# Altium project Car_reader.PrjPcb
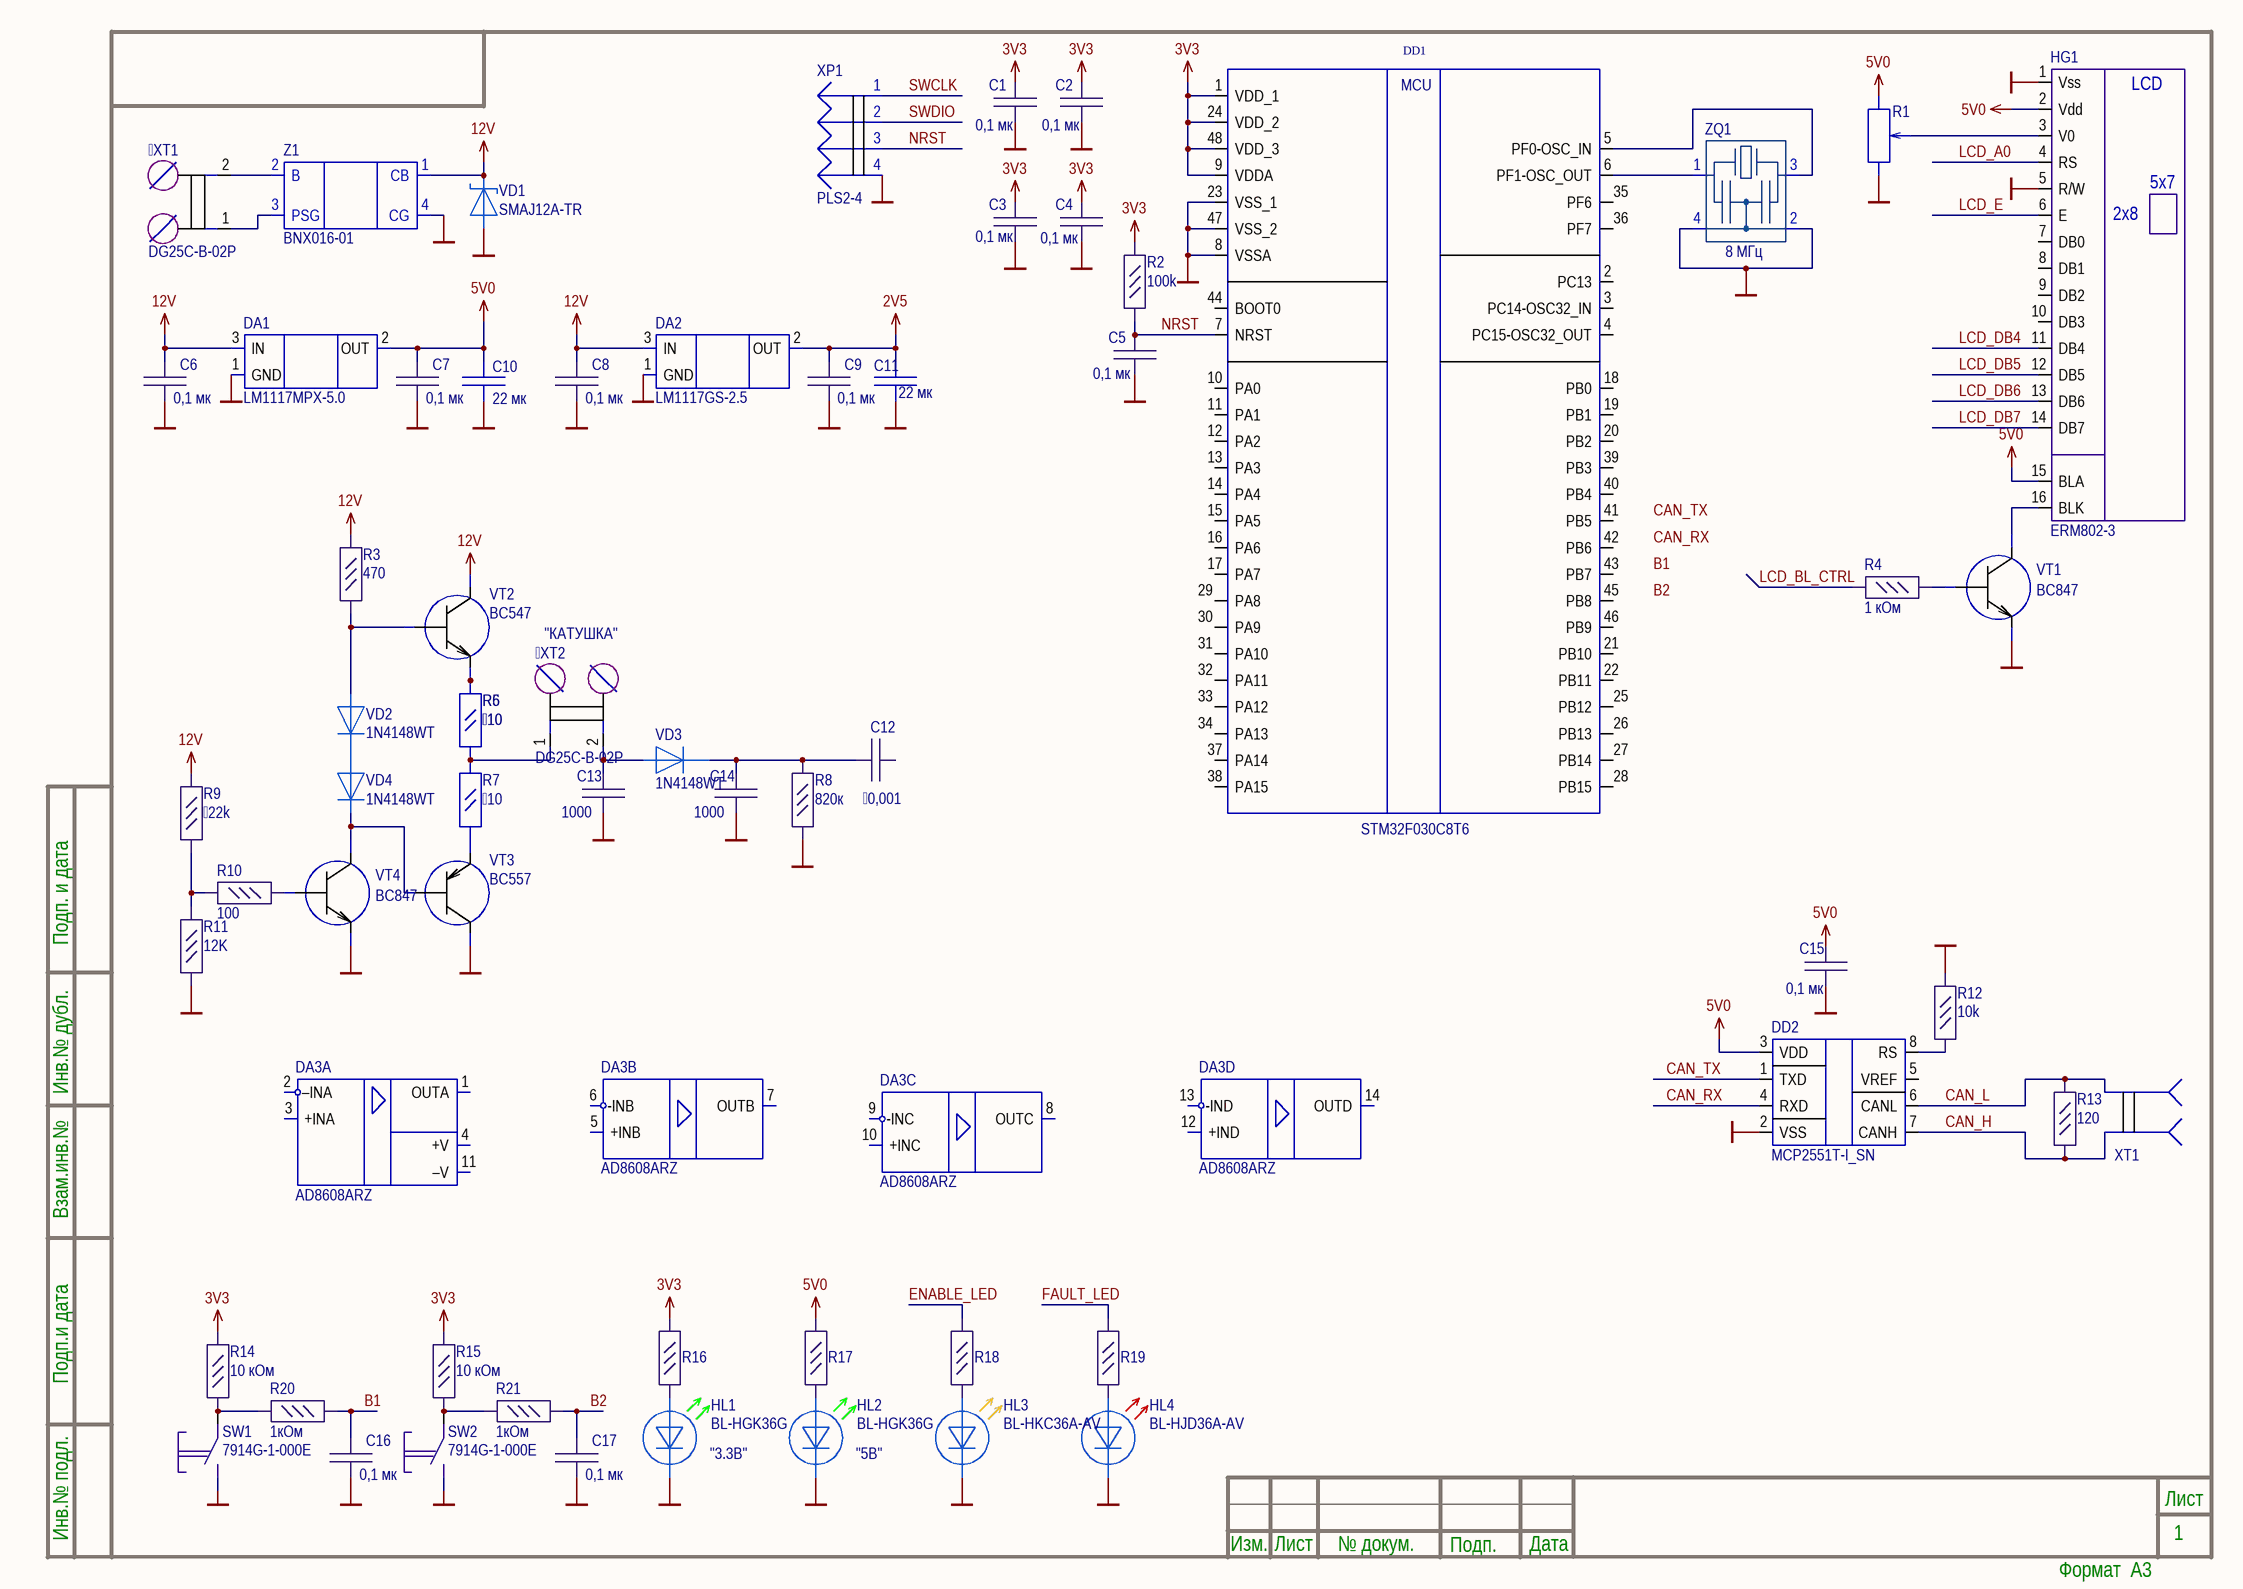
[diagram p0: Sheet1.SchDoc]
1 sheet, 64 parts. Net scope: global (net labels, ports and power ports of the same name join across sheets).
Board file: Car_reader_pcb.PcbDoc

## Sheet Sheet1.SchDoc
size 420 x 297 mm; SheetNumber: 1; SheetTotal: 1

### Parts
XT1  DG25C-B-02P  [DG25C-B-02P]
XT2  DG25C-B-02P  [DG25C-B-02P]
C1  0,1 мк  [C_0603]
C2  0,1 мк  [C_0603]
C3  0,1 мк  [C_0603]
C4  0,1 мк  [C_0603]
C5  0,1 мк  [C_0603]
C6  0,1 мк  [C_0603]
C7  0,1 мк  [C_0603]
C8  0,1 мк  [C_0603]
C9  0,1 мк  [C_0603]
C10  22 мк  [C_1210]
C11  22 мк  [C_1210]
C12  0,001  [C_0603]
C13  1000  [C_0603]
C14  1000  [C_0603]
C15  0,1 мк  [C_0603]
C16  0,1 мк  [C_0603]
C17  0,1 мк  [C_0603]
DA1  LM1117MPX-5.0  [sot223]
DA2  LM1117GS-2.5  [SOT223]
DA3  AD8608ARZ  [SO-14]  (parts A,B,C,D of 4)
DD1  STM32F030C8T6  [LQFP48]
DD2  MCP2551T-I_SN  [SOIC127P600X175-8N]
HG1  ERM802-3  [ERM802]
HL1  BL-HGK36G  [LED_0603_GREEN]
HL2  BL-HGK36G  [LED_0603_GREEN]
HL3  BL-HKC36A-AV  [LED_0603_GREEN]
HL4  BL-HJD36A-AV  [LED_0603_RED]
R1  3214W-1-103E  [3214W Bourns]  (value not drawn)
R2  100k  [R_0603]
R3  470  [R_0603]
R4  1 кОм  [R_0603]
R5  10  [R_1206]
R6  10  [R_1206]
R7  10  [R_1206]
R8  820к  [R_0603]
R9  22k  [R_0603]
R10  100  [R_0603]
R11  12K  [R_0603]
R12  10k  [R_0603]
R13  120  [R_0603]
R14  10 кОм  [R_0603]
R15  10 кОм  [R_0603]
R16  470  [R_0603]  (value not drawn)
R17  470  [R_0603]  (value not drawn)
R18  470  [R_0603]  (value not drawn)
R19  470  [R_0603]  (value not drawn)
R20  1кОм  [R_0603]
R21  1кОм  [R_0603]
SW1  7914G-1-000E  [7914G]
SW2  7914G-1-000E  [7914G]
VD1  SMAJ12A-TR  [DO-214AC]
VD2  1N4148WT  [SOD-523F]
VD3  1N4148WT  [SOD-523F]
VD4  1N4148WT  [SOD-523F]
VT1  BC847  [SOT23]
VT2  BC547  [КТ-26]
VT3  BC557  [КТ-26]
VT4  BC847  [SOT23]
XP1  PLS2-4  [PLS2-4]
XT1  DG308-2.54-02P  [DG308-2.54-02P]  (value not drawn)
Z1  BNX016-01  [BNX01]
ZQ1  8 МГц  [MJ CRYSTAL]

### Nets
2V5: C9.2 C11.2 DA2.2(OUT)
3V3: C1.2 C2.2 C3.2 C4.2 DD1.1(VDD_1) DD1.9(VDDA) DD1.24(VDD_2) DD1.48(VDD_3) R2.1 R14.2 R15.2 R16.2
5V0: C7.2 C10.1 C15.2 DA1.2(OUT) DD2.3(VDD) HG1.2(Vdd) HG1.15(BLA) R1.1 R17.2
12V: C6.2 C8.2 DA1.3(IN) DA2.3(IN) R3.1 R9.2 VD1.2 VT2.1(C) Z1.1(CB)
GND: C1.1 C2.1 C3.1 C4.1 C5.1 C6.1 C7.1 C8.1 C9.1 C10.2 C11.1 C13.1 C14.1 C15.1 C16.1 C17.1 DA1.1(GND) DA2.1(GND) DD1.8(VSSA) DD1.23(VSS_1) DD1.47(VSS_2) DD2.2(VSS) HG1.1(Vss) HG1.5(R/W) HL1.2 HL2.2 HL3.2 HL4.2 R1.3 R8.1 R11.2 R12.2 SW1.1 SW2.1 VD1.1 VT1.2(E) VT3.1(C) VT4.2(E) XP1.4 Z1.4(CG) ZQ1.2 ZQ1.4
B1: C16.2 R20.1
B2: C17.2 R21.1
CAN_H: DD2.7(CANH) R13.2 XT1.1
CAN_L: DD2.6(CANL) R13.1 XT1.2
CAN_RX: DD2.4(RXD)
CAN_TX: DD2.1(TXD)
ENABLE_LED: R18.2
FAULT_LED: R19.2
LCD_A0: HG1.4(RS)
LCD_BL_CTRL: R4.2
LCD_DB4: HG1.11(DB4)
LCD_DB5: HG1.12(DB5)
LCD_DB6: HG1.13(DB6)
LCD_DB7: HG1.14(DB7)
LCD_E: HG1.6(E)
NRST: C5.2 DD1.7(NRST) R2.2 XP1.3
SWCLK: XP1.1
SWDIO: XP1.2
NetXT1_1: XT1.1 Z1.3(PSG)
NetXT1_2: XT1.2 Z1.2(B)
NetXT2_1: XT2.1 R5.1 R6.1 R7.2
NetXT2_2: XT2.2 C13.2 VD3.2
NetC12_2: C12.2 C14.2 R8.2 VD3.1
NetDD1_5: DD1.5(PF0-OSC_IN) ZQ1.3
NetDD1_6: DD1.6(PF1-OSC_OUT) ZQ1.1
NetDD2_8: DD2.8(RS) R12.1
NetHG1_3: HG1.3(V0) R1.2
NetHG1_16: HG1.16(BLK) VT1.3(C)
NetHL1_1: HL1.1 R16.1
NetHL2_1: HL2.1 R17.1
NetHL3_1: HL3.1 R18.1
NetHL4_1: HL4.1 R19.1
NetR3_2: R3.2 VD2.2 VT2.2(B)
NetR4_1: R4.1 VT1.1(B)
NetR5_2: R5.2 R6.2 VT2.3(E)
NetR7_1: R7.1 VT3.3(E)
NetR9_1: R9.1 R10.1 R11.1
NetR10_2: R10.2 VT4.1(B)
NetR14_1: R14.1 R20.2 SW1.2
NetR15_1: R15.1 R21.2 SW2.2
NetVD2_1: VD2.1 VD4.2
NetVD4_1: VD4.1 VT3.2(B) VT4.3(C)

Not connected (* = marked no-connect by the designer): C12 1; DA3 1(OUTA) 2(–INA) 3(+INA) 4(+V) 5(+INB) 6(-INB) 7(OUTB) 8(OUTC) 9(-INC) 10(+INC) 11(–V) 12(+IND) 13(-IND) 14(OUTD); DD1 2(PC13) 3(PC14-OSC32_IN) 4(PC15-OSC32_OUT) 10(PA0) 11(PA1) 12(PA2) 13(PA3) 14(PA4) 15(PA5) 16(PA6) 17(PA7) 18(PB0) 19(PB1) 20(PB2) 21(PB10) 22(PB11) 25(PB12) 26(PB13) 27(PB14) 28(PB15) 29(PA8) 30(PA9) 31(PA10) 32(PA11) 33(PA12) 34(PA13) 35(PF6) 36(PF7) 37(PA14) 38(PA15) 39(PB3) 40(PB4) 41(PB5) 42(PB6) 43(PB7) 44(BOOT0) 45(PB8) 46(PB9); DD2 5(VREF); HG1 7(DB0) 8(DB1) 9(DB2) 10(DB3)

### Notes on the sheet
- "КАТУШКА"
- "3.3B"
- (near HL2) "5B"
- Labels drawn without touching a wire or pin: B1, B2, CAN_RX, CAN_TX
- Подп. и дата
- Инв.№ дубл.
- Взам.инв.№
- Подп.и дата
- Инв.№ подл.
- Изм.
- Лист
- № докум.
- Подп.
- Дата
- Формат  A3
- (in symbol ERM802-3) LCD; 5x7; 2x8
- (in symbol STM32F030C8T6) MCU

### Library data of the parts
C1-C9 C12-C17 = GRM188R72A104KA35D: CAP CER 0.1UF 100V X7R 0603; Manufacturer: Murata Electronics; Value: 0.1µF; Part Number: GRM188R72A104KA35D; ComponentLink1URL: https://www.murata.com/~/media/webrenewal/support/library/catalog/products/capacitor/mlcc/c02e.ashx?la=en-us; ComponentLink1Description: Datasheet; Component Type: Capasitor
C10 C11 = GRM32ER71E226KE15L
DD1 = STM32F030C8T6: Manufacturer_Name: STMicroelectronics; Datasheet Link: http://www.st.com/web/en/resource/technical/document/datasheet/DM00088500.pdf; Height: 1.6mm; Manufacturer_Part_Number: STM32F030C8T6; Mouser Part Number: 511-STM32F030C8T6; Mouser Price/Stock: https://www.mouser.co.uk/ProductDetail/STMicroelectronics/STM32F030C8T6?qs=eyrSuY1LhL02NUjnPm0S4A%3D%3D; Arrow Part Number: STM32F030C8T6; Arrow Price/Stock: https://www.arrow.com/en/products/stm32f030c8t6/stmicroelectronics?region=nac
HL1 HL2 = BL-HGK36G: SMD LED 0603 TOP зеленый
HL3 = BL-HKC36A-AV: SMD LED 0603 TOP желтый
HL4 = BL-HJD36A-AV: SMD LED 0603 TOP красный
R2 R3 R8-R12 = CR0603-FX-82R0ELF: RES SMD 82 OHM 1% 1/10W 0603; Manufacturer: Bourns Inc.; Value: 82; Part Number: CR0603-FX-82R0ELF; ComponentLink1URL: https://www.bourns.com/pdfs/chpreztr.pdf; ComponentLink1Description: Datasheet; Component Type: Resistor
R4 = CR0603-FX-1001ELF: RES SMD 1K OHM 1% 1/10W 0603; Manufacturer: Bourns Inc.; Part Number: CR0603-FX-1001ELF; Value: 1 кОм; ComponentLink1URL: https://www.bourns.com/pdfs/chpreztr.pdf; ComponentLink1Description: Datasheet; Component Type: Resistor
R5-R7 = R_1206
R13 = CR0603-FX-1001ELF: RES SMD 1K OHM 1% 1/10W 0603; Manufacturer: Bourns Inc.; Value: 1 кОм; Part Number: CR0603-FX-1001ELF; ComponentLink1URL: https://www.bourns.com/pdfs/chpreztr.pdf; ComponentLink1Description: Datasheet; Component Type: Resistor
R14 R15 = CR0603-FX-1002ELF: RES SMD 10K OHM 1% 1/10W 0603; Manufacturer: Bourns Inc.; Part Number: CR0603-FX-1002ELF; Value: 10 кОм; ComponentLink1URL: https://www.bourns.com/pdfs/chpreztr.pdf; ComponentLink1Description: Datasheet; Component Type: Resistor
R16-R19 = CR0603-FX-4700ELF: RES SMD 470 OHM 1% 1/10W 0603; Manufacturer: Bourns Inc.; Part Number: CR0603-FX-4700ELF; Value: 470; ComponentLink1URL: https://www.bourns.com/pdfs/chpreztr.pdf; ComponentLink1Description: Datasheet; Component Type: Resistor
R20 R21 = CR0603-FX-1002ELF: RES SMD 10K OHM 1% 1/10W 0603; Manufacturer: Bourns Inc.; Value: 10 кОм; Part Number: CR0603-FX-1002ELF; ComponentLink1URL: https://www.bourns.com/pdfs/chpreztr.pdf; ComponentLink1Description: Datasheet; Component Type: Resistor
SW1 SW2 = 7914G-1-000E: Тактовый переключатель SMD
VD1 = SMAJ12A-TR: Защитный диод 400Вт 12В
VD2-VD4 = 1N4148WT: Диод
Z1 = BNX016-01: 25В 15А 40дБ, LC фильтр
ZQ1 = MJ-8.000-12